# Altium schematic sheet ADC-ADC PSU.SchDoc: <SPECIFIC SHEET FUNCTION>
size A3; Date: DO NOT USE, RATHER USE PROJ OPTIONS; DrawnBy: DO NOT USE, RATHER USE PROJ OPTIONS; Engineer: DO NOT USE, RATHER USE PROJ OPTIONS; Organization: DO NOT USE, RATHER USE PROJ OPTIONS; DocumentNumber: 1; Revision: DO NOT USE, RATHER USE PROJ OPTIONS; SheetNumber: 9; SheetTotal: 12; SCH_Sheet_Filename: ADC-ADC PSU.SchDoc; CurrentTime: DO NOT USE, RATHER USE PROJ OPTIONS; Time: DO NOT USE, RATHER USE PROJ OPTIONS; DocumentFullPathAndName: DO NOT USE, RATHER USE PROJ OPTIONS; DocumentName: DO NOT USE, RATHER USE PROJ OPTIONS; ModifiedDate: DO NOT USE, RATHER USE PROJ OPTIONS; ImagePath: DO NOT USE, RATHER USE PROJ OPTIONS
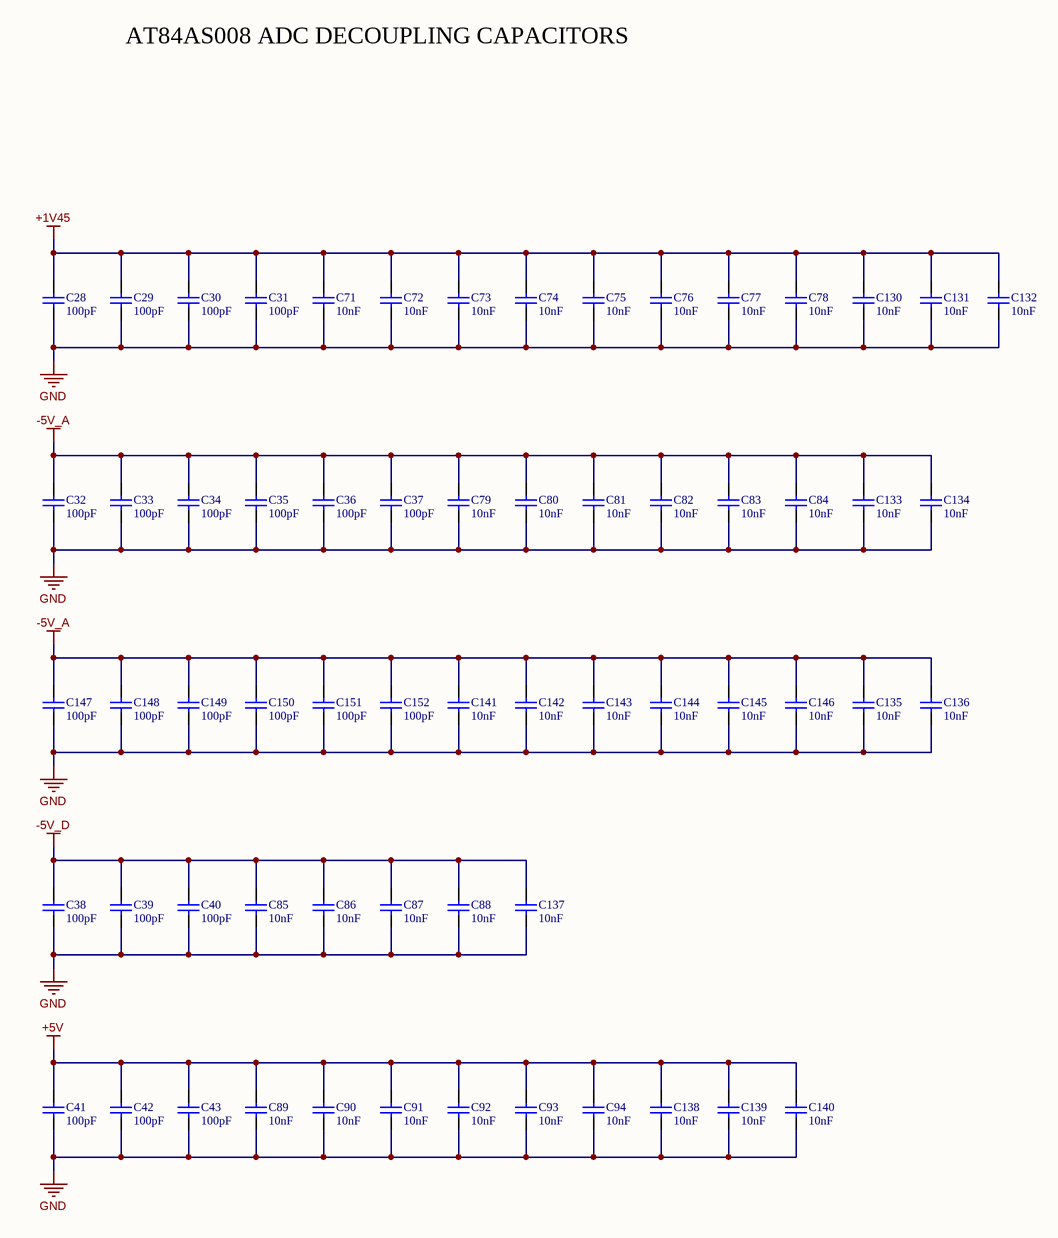
[diagram p0: ADC-ADC PSU.SchDoc]

## Parts
C28  value 100pF  [CAPC1005X55N]  (hidden comment: Capacitor 0402 SMD)
C29  value 100pF  [CAPC1005X55N]  (hidden comment: Capacitor 0402 SMD)
C30  value 100pF  [CAPC1005X55N]  (hidden comment: Capacitor 0402 SMD)
C31  value 100pF  [CAPC1005X55N]  (hidden comment: Capacitor 0402 SMD)
C32  value 100pF  [CAPC1005X55N]  (hidden comment: Capacitor 0402 SMD)
C33  value 100pF  [CAPC1005X55N]  (hidden comment: Capacitor 0402 SMD)
C34  value 100pF  [CAPC1005X55N]  (hidden comment: Capacitor 0402 SMD)
C35  value 100pF  [CAPC1005X55N]  (hidden comment: Capacitor 0402 SMD)
C36  value 100pF  [CAPC1005X55N]  (hidden comment: Capacitor 0402 SMD)
C37  value 100pF  [CAPC1005X55N]  (hidden comment: Capacitor 0402 SMD)
C38  value 100pF  [CAPC1005X55N]  (hidden comment: Capacitor 0402 SMD)
C39  value 100pF  [CAPC1005X55N]  (hidden comment: Capacitor 0402 SMD)
C40  value 100pF  [CAPC1005X55N]  (hidden comment: Capacitor 0402 SMD)
C41  value 100pF  [CAPC1005X55N]  (hidden comment: Capacitor 0402 SMD)
C42  value 100pF  [CAPC1005X55N]  (hidden comment: Capacitor 0402 SMD)
C43  value 100pF  [CAPC1005X55N]  (hidden comment: Capacitor 0402 SMD)
C71  value 10nF  [CAPC1005X55N]  (hidden comment: Capacitor 0402 SMD)
C72  value 10nF  [CAPC1005X55N]  (hidden comment: Capacitor 0402 SMD)
C73  value 10nF  [CAPC1005X55N]  (hidden comment: Capacitor 0402 SMD)
C74  value 10nF  [CAPC1005X55N]  (hidden comment: Capacitor 0402 SMD)
C75  value 10nF  [CAPC1005X55N]  (hidden comment: Capacitor 0402 SMD)
C76  value 10nF  [CAPC1005X55N]  (hidden comment: Capacitor 0402 SMD)
C77  value 10nF  [CAPC1005X55N]  (hidden comment: Capacitor 0402 SMD)
C78  value 10nF  [CAPC1005X55N]  (hidden comment: Capacitor 0402 SMD)
C79  value 10nF  [CAPC1005X55N]  (hidden comment: Capacitor 0402 SMD)
C80  value 10nF  [CAPC1005X55N]  (hidden comment: Capacitor 0402 SMD)
C81  value 10nF  [CAPC1005X55N]  (hidden comment: Capacitor 0402 SMD)
C82  value 10nF  [CAPC1005X55N]  (hidden comment: Capacitor 0402 SMD)
C83  value 10nF  [CAPC1005X55N]  (hidden comment: Capacitor 0402 SMD)
C84  value 10nF  [CAPC1005X55N]  (hidden comment: Capacitor 0402 SMD)
C85  value 10nF  [CAPC1005X55N]  (hidden comment: Capacitor 0402 SMD)
C86  value 10nF  [CAPC1005X55N]  (hidden comment: Capacitor 0402 SMD)
C87  value 10nF  [CAPC1005X55N]  (hidden comment: Capacitor 0402 SMD)
C88  value 10nF  [CAPC1005X55N]  (hidden comment: Capacitor 0402 SMD)
C89  value 10nF  [CAPC1005X55N]  (hidden comment: Capacitor 0402 SMD)
C90  value 10nF  [CAPC1005X55N]  (hidden comment: Capacitor 0402 SMD)
C91  value 10nF  [CAPC1005X55N]  (hidden comment: Capacitor 0402 SMD)
C92  value 10nF  [CAPC1005X55N]  (hidden comment: Capacitor 0402 SMD)
C93  value 10nF  [CAPC1005X55N]  (hidden comment: Capacitor 0402 SMD)
C94  value 10nF  [CAPC1005X55N]  (hidden comment: Capacitor 0402 SMD)
C130  value 10nF  [CAPC1005X55N]  (hidden comment: Capacitor 0402 SMD)
C131  value 10nF  [CAPC1005X55N]  (hidden comment: Capacitor 0402 SMD)
C132  value 10nF  [CAPC1005X55N]  (hidden comment: Capacitor 0402 SMD)
C133  value 10nF  [CAPC1005X55N]  (hidden comment: Capacitor 0402 SMD)
C134  value 10nF  [CAPC1005X55N]  (hidden comment: Capacitor 0402 SMD)
C135  value 10nF  [CAPC1005X55N]  (hidden comment: Capacitor 0402 SMD)
C136  value 10nF  [CAPC1005X55N]  (hidden comment: Capacitor 0402 SMD)
C137  value 10nF  [CAPC1005X55N]  (hidden comment: Capacitor 0402 SMD)
C138  value 10nF  [CAPC1005X55N]  (hidden comment: Capacitor 0402 SMD)
C139  value 10nF  [CAPC1005X55N]  (hidden comment: Capacitor 0402 SMD)
C140  value 10nF  [CAPC1005X55N]  (hidden comment: Capacitor 0402 SMD)
C141  value 10nF  [CAPC1005X55N]  (hidden comment: Capacitor 0402 SMD)
C142  value 10nF  [CAPC1005X55N]  (hidden comment: Capacitor 0402 SMD)
C143  value 10nF  [CAPC1005X55N]  (hidden comment: Capacitor 0402 SMD)
C144  value 10nF  [CAPC1005X55N]  (hidden comment: Capacitor 0402 SMD)
C145  value 10nF  [CAPC1005X55N]  (hidden comment: Capacitor 0402 SMD)
C146  value 10nF  [CAPC1005X55N]  (hidden comment: Capacitor 0402 SMD)
C147  value 100pF  [CAPC1005X55N]  (hidden comment: Capacitor 0402 SMD)
C148  value 100pF  [CAPC1005X55N]  (hidden comment: Capacitor 0402 SMD)
C149  value 100pF  [CAPC1005X55N]  (hidden comment: Capacitor 0402 SMD)
C150  value 100pF  [CAPC1005X55N]  (hidden comment: Capacitor 0402 SMD)
C151  value 100pF  [CAPC1005X55N]  (hidden comment: Capacitor 0402 SMD)
C152  value 100pF  [CAPC1005X55N]  (hidden comment: Capacitor 0402 SMD)

## Nets
+1V45: C28.1 C29.1 C30.1 C31.1 C71.1 C72.1 C73.1 C74.1 C75.1 C76.1 C77.1 C78.1 C130.1 C131.1 C132.1
+5V: C41.1 C42.1 C43.1 C89.1 C90.1 C91.1 C92.1 C93.1 C94.1 C138.1 C139.1 C140.1
-5V_A: C32.1 C33.1 C34.1 C35.1 C36.1 C37.1 C79.1 C80.1 C81.1 C82.1 C83.1 C84.1 C133.1 C134.1 C135.1 C136.1 C141.1 C142.1 C143.1 C144.1 C145.1 C146.1 C147.1 C148.1 C149.1 C150.1 C151.1 C152.1
-5V_D: C38.1 C39.1 C40.1 C85.1 C86.1 C87.1 C88.1 C137.1
GND: C28.2 C29.2 C30.2 C31.2 C32.2 C33.2 C34.2 C35.2 C36.2 C37.2 C38.2 C39.2 C40.2 C41.2 C42.2 C43.2 C71.2 C72.2 C73.2 C74.2 C75.2 C76.2 C77.2 C78.2 C79.2 C80.2 C81.2 C82.2 C83.2 C84.2 C85.2 C86.2 C87.2 C88.2 C89.2 C90.2 C91.2 C92.2 C93.2 C94.2 C130.2 C131.2 C132.2 C133.2 C134.2 C135.2 C136.2 C137.2 C138.2 C139.2 C140.2 C141.2 C142.2 C143.2 C144.2 C145.2 C146.2 C147.2 C148.2 C149.2 C150.2 C151.2 C152.2

## Notes on the sheet
- AT84AS008 ADC DECOUPLING CAPACITORS
- 2009   THIS DOCUMENT IS THE PROPERTY OF THE OWNER, AND MAY NOT BE COPIED OR USED FOR ANY PURPOSE OTHER THAN THAT FOR WHICH IT IS SUPPLIED WITHOUT PERMISSION IN WRITING FROM THE OWNER.
- C
- DATESTAMP OF THIS PRINT
- DRAWN BY:
- DOCUMENT NUMBER:
- SCHEMATIC FILENAME:
- PCB FILENAME:
- ENGINEER:
- APPROVED:
- CIRCUIT DIAGRAM
- DATE
- SHEET
- REVISION
- OF

## Library data of the parts
C28-C43 C71-C94 C130-C152 = cap0402: Created_By: EDA-ASA; Checked_By: *; Checked_Date: *; HelpURL: *; Supplier1: *; Supplier2: *; Unit_Cost: *; MOQ: *; Leadtime: *; Inventory_Stock: *; Tolerance: *; Wattage: *; Package: 0402; ComponentLinked1Description: *; ComponentLinked1URL: *; ComponentLinked2Description: *; ComponentLinked2URL: *; ComponentLinked3Description: *; ComponentLinked3URL: *; ComponentLinked4Description: *; ComponentLinked4URL: *